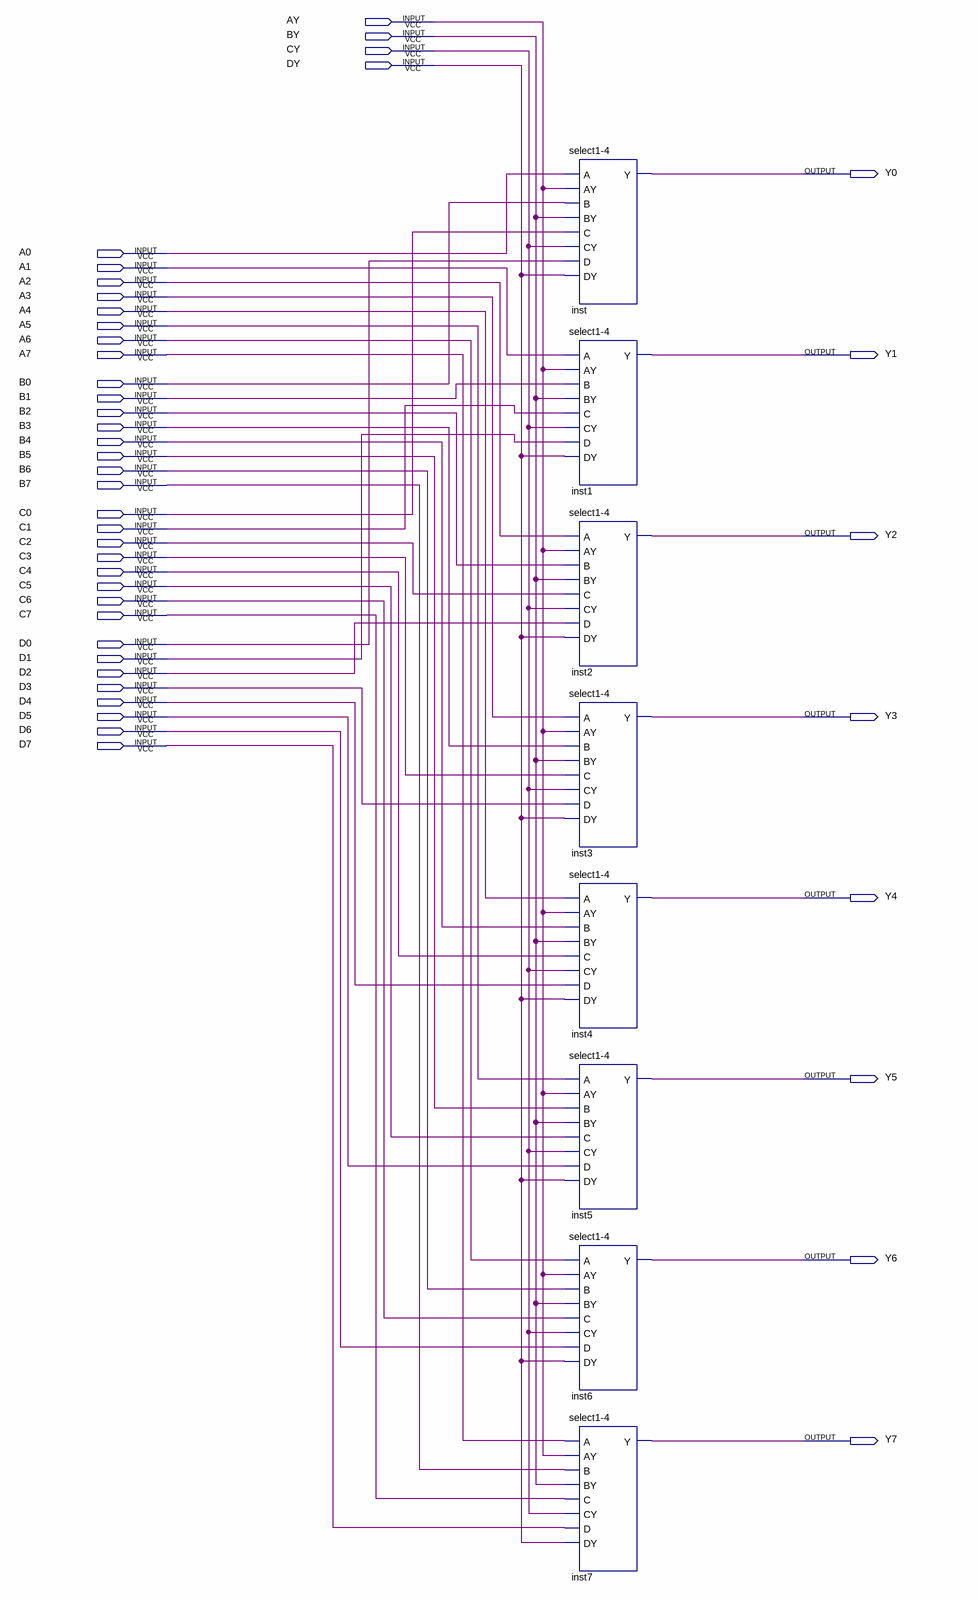
[diagram p0: schematic sheet]
// Quartus schematic select8-4.bdf as structural Verilog: 8 symbols, 44 pins
module \select8-4  (
  input  AY,
  input  BY,
  input  CY,
  input  DY,
  input  A0,
  input  A1,
  input  A2,
  input  A3,
  input  A4,
  input  A5,
  input  A6,
  input  A7,
  input  B0,
  input  B1,
  input  B2,
  input  B3,
  input  B4,
  input  B5,
  input  B6,
  input  B7,
  input  C0,
  input  C1,
  input  C2,
  input  C3,
  input  C4,
  input  C5,
  input  C6,
  input  C7,
  input  D0,
  input  D1,
  input  D2,
  input  D3,
  input  D4,
  input  D5,
  input  D6,
  input  D7,
  output Y0,
  output Y1,
  output Y2,
  output Y3,
  output Y4,
  output Y5,
  output Y6,
  output Y7
);

  \select1-4  inst (.A(A0), .AY(AY), .B(B0), .BY(BY), .C(C0), .CY(CY), .D(D0), .DY(DY), .Y(Y0));
  \select1-4  inst1 (.A(A1), .AY(AY), .B(B1), .BY(BY), .C(C1), .CY(CY), .D(D1), .DY(DY), .Y(Y1));
  \select1-4  inst2 (.A(A2), .AY(AY), .B(B2), .BY(BY), .C(C2), .CY(CY), .D(D2), .DY(DY), .Y(Y2));
  \select1-4  inst3 (.A(A3), .AY(AY), .B(B3), .BY(BY), .C(C3), .CY(CY), .D(D3), .DY(DY), .Y(Y3));
  \select1-4  inst4 (.A(A4), .AY(AY), .B(B4), .BY(BY), .C(C4), .CY(CY), .D(D4), .DY(DY), .Y(Y4));
  \select1-4  inst5 (.A(A5), .AY(AY), .B(B5), .BY(BY), .C(C5), .CY(CY), .D(D5), .DY(DY), .Y(Y5));
  \select1-4  inst6 (.A(A6), .AY(AY), .B(B6), .BY(BY), .C(C6), .CY(CY), .D(D6), .DY(DY), .Y(Y6));
  \select1-4  inst7 (.A(A7), .AY(AY), .B(B7), .BY(BY), .C(C7), .CY(CY), .D(D7), .DY(DY), .Y(Y7));
endmodule
